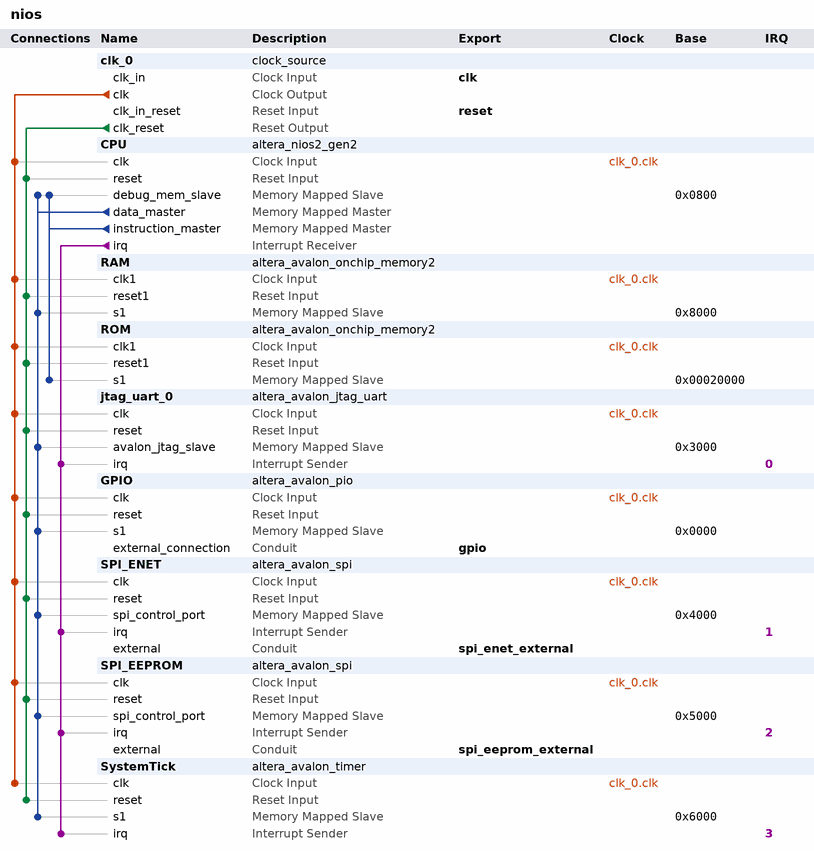
[diagram p0: system contents]
# Platform Designer (Qsys) system nios, Cyclone IV E EP4CE10E22C8
# Parameters at their usual value, and those the tool derives, are not listed.
package require -exact qsys 17.1
create_system nios
set_project_property DEVICE_FAMILY {Cyclone IV E}
set_project_property DEVICE EP4CE10E22C8

add_instance clk_0 clock_source 17.1
set_instance_parameter_value clk_0 clockFrequency 50000000

add_instance CPU altera_nios2_gen2 17.1
set_instance_parameter_value CPU dcache_size 2048
set_instance_parameter_value CPU exceptionSlave ROM.s1
set_instance_parameter_value CPU icache_size 4096
set_instance_parameter_value CPU impl Tiny
set_instance_parameter_value CPU resetSlave ROM.s1

add_instance RAM altera_avalon_onchip_memory2 17.1
set_instance_parameter_value RAM dataWidth 32
set_instance_parameter_value RAM dualPort false
set_instance_parameter_value RAM initMemContent true
set_instance_parameter_value RAM initializationFileName onchip_mem.hex
set_instance_parameter_value RAM memorySize 8192

add_instance ROM altera_avalon_onchip_memory2 17.1
set_instance_parameter_value ROM dataWidth 32
set_instance_parameter_value ROM dualPort false
set_instance_parameter_value ROM initMemContent true
set_instance_parameter_value ROM initializationFileName onchip_mem.hex
set_instance_parameter_value ROM memorySize 32768
set_instance_parameter_value ROM writable false

add_instance jtag_uart_0 altera_avalon_jtag_uart 17.1
set_instance_parameter_value jtag_uart_0 simInteractiveOptions NO_INTERACTIVE_WINDOWS

add_instance GPIO altera_avalon_pio 17.1
set_instance_parameter_value GPIO direction Output
set_instance_parameter_value GPIO width 32

add_instance SPI_ENET altera_avalon_spi 17.1
set_instance_parameter_value SPI_ENET clockPolarity 0
set_instance_parameter_value SPI_ENET dataWidth 8
set_instance_parameter_value SPI_ENET masterSPI true
set_instance_parameter_value SPI_ENET numberOfSlaves 1
set_instance_parameter_value SPI_ENET targetClockRate 10000000

add_instance SPI_EEPROM altera_avalon_spi 17.1
set_instance_parameter_value SPI_EEPROM clockPolarity 0
set_instance_parameter_value SPI_EEPROM dataWidth 8
set_instance_parameter_value SPI_EEPROM masterSPI true
set_instance_parameter_value SPI_EEPROM numberOfSlaves 1
set_instance_parameter_value SPI_EEPROM targetClockRate 128000

add_instance SystemTick altera_avalon_timer 17.1
set_instance_parameter_value SystemTick alwaysRun true
set_instance_parameter_value SystemTick fixedPeriod true
set_instance_parameter_value SystemTick period 125000
set_instance_parameter_value SystemTick periodUnits CLOCKS

# connections
add_connection clk_0.clk CPU.clk clock
add_connection clk_0.clk GPIO.clk clock
add_connection clk_0.clk jtag_uart_0.clk clock
add_connection clk_0.clk RAM.clk1 clock
add_connection clk_0.clk ROM.clk1 clock
add_connection clk_0.clk SPI_EEPROM.clk clock
add_connection clk_0.clk SPI_ENET.clk clock
add_connection clk_0.clk SystemTick.clk clock
add_connection clk_0.clk_reset CPU.reset reset
add_connection clk_0.clk_reset GPIO.reset reset
add_connection clk_0.clk_reset jtag_uart_0.reset reset
add_connection clk_0.clk_reset RAM.reset1 reset
add_connection clk_0.clk_reset ROM.reset1 reset
add_connection clk_0.clk_reset SPI_EEPROM.reset reset
add_connection clk_0.clk_reset SPI_ENET.reset reset
add_connection clk_0.clk_reset SystemTick.reset reset
add_connection CPU.data_master CPU.debug_mem_slave avalon
set_connection_parameter_value CPU.data_master/CPU.debug_mem_slave baseAddress 0x0800
add_connection CPU.data_master GPIO.s1 avalon
set_connection_parameter_value CPU.data_master/GPIO.s1 baseAddress 0x0000
add_connection CPU.data_master jtag_uart_0.avalon_jtag_slave avalon
set_connection_parameter_value CPU.data_master/jtag_uart_0.avalon_jtag_slave baseAddress 0x3000
add_connection CPU.data_master RAM.s1 avalon
set_connection_parameter_value CPU.data_master/RAM.s1 baseAddress 0x8000
add_connection CPU.data_master SPI_EEPROM.spi_control_port avalon
set_connection_parameter_value CPU.data_master/SPI_EEPROM.spi_control_port baseAddress 0x5000
add_connection CPU.data_master SPI_ENET.spi_control_port avalon
set_connection_parameter_value CPU.data_master/SPI_ENET.spi_control_port baseAddress 0x4000
add_connection CPU.data_master SystemTick.s1 avalon
set_connection_parameter_value CPU.data_master/SystemTick.s1 baseAddress 0x6000
add_connection CPU.instruction_master CPU.debug_mem_slave avalon
set_connection_parameter_value CPU.instruction_master/CPU.debug_mem_slave baseAddress 0x0800
add_connection CPU.instruction_master ROM.s1 avalon
set_connection_parameter_value CPU.instruction_master/ROM.s1 baseAddress 0x00020000
add_connection CPU.irq jtag_uart_0.irq interrupt
set_connection_parameter_value CPU.irq/jtag_uart_0.irq irqNumber 0
add_connection CPU.irq SPI_EEPROM.irq interrupt
set_connection_parameter_value CPU.irq/SPI_EEPROM.irq irqNumber 2
add_connection CPU.irq SPI_ENET.irq interrupt
set_connection_parameter_value CPU.irq/SPI_ENET.irq irqNumber 1
add_connection CPU.irq SystemTick.irq interrupt
set_connection_parameter_value CPU.irq/SystemTick.irq irqNumber 3

# exported interfaces
add_interface clk clock sink
set_interface_property clk EXPORT_OF clk_0.clk_in
add_interface gpio conduit end
set_interface_property gpio EXPORT_OF GPIO.external_connection
add_interface reset reset sink
set_interface_property reset EXPORT_OF clk_0.clk_in_reset
add_interface spi_eeprom_external conduit end
set_interface_property spi_eeprom_external EXPORT_OF SPI_EEPROM.external
add_interface spi_enet_external conduit end
set_interface_property spi_enet_external EXPORT_OF SPI_ENET.external

set_interconnect_requirement {$system} qsys_mm.clockCrossingAdapter HANDSHAKE
set_interconnect_requirement {$system} qsys_mm.enableEccProtection FALSE
set_interconnect_requirement {$system} qsys_mm.insertDefaultSlave FALSE
set_interconnect_requirement {$system} qsys_mm.maxAdditionalLatency 1

save_system nios.qsys
